# Altium schematic sheet [15] Sensors.SchDoc: Measurement sensors
size A4; Engineer: M. Folejewski; DocumentNumber: 15; SheetNumber: 15; SheetTotal: 17; PageSize: A4; Designators: 900-949
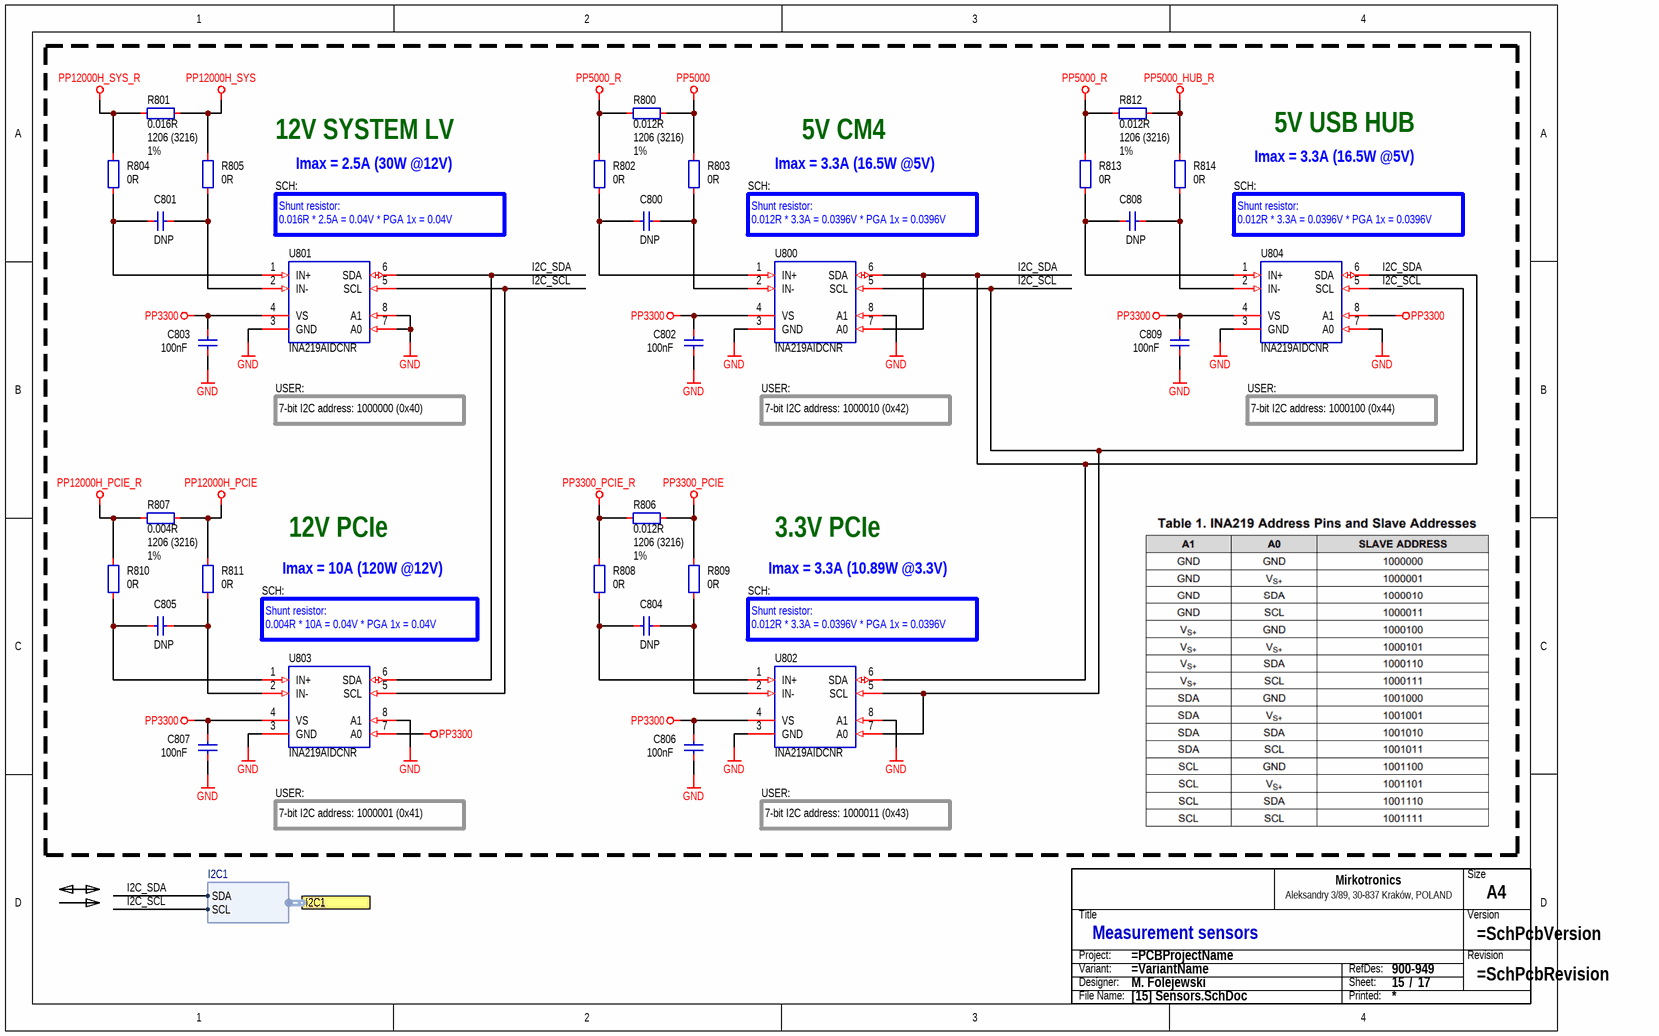
[diagram p0: [15] Sensors.SchDoc]

## Parts
C800  DNP  [CAP_0603_R]
C801  DNP  [CAP_0603_R]
C802  100nF  [CAP_0603_R]
C803  100nF  [CAP_0603_R]
C804  DNP  [CAP_0603_R]
C805  DNP  [CAP_0603_R]
C806  100nF  [CAP_0603_R]
C807  100nF  [CAP_0603_R]
C808  DNP  [CAP_0603_R]
C809  100nF  [CAP_0603_R]
R800  0.012R  Package (Case): 1206 (3216)  Tolerance: 1%  [RES_1206_R]
R801  0.016R  Package (Case): 1206 (3216)  Tolerance: 1%  [RES_1206_R]
R802  0R  [RES_0603_R]
R803  0R  [RES_0603_R]
R804  0R  [RES_0603_R]
R805  0R  [RES_0603_R]
R806  0.012R  Package (Case): 1206 (3216)  Tolerance: 1%  [RES_1206_R]
R807  0.004R  Package (Case): 1206 (3216)  Tolerance: 1%  [RES_1206_R]
R808  0R  [RES_0603_R]
R809  0R  [RES_0603_R]
R810  0R  [RES_0603_R]
R811  0R  [RES_0603_R]
R812  0.012R  Package (Case): 1206 (3216)  Tolerance: 1%  [RES_1206_R]
R813  0R  [RES_0603_R]
R814  0R  [RES_0603_R]
TB?  Title block  (value not drawn)  (graphical)
U800  INA219AIDCNR  [ICC_SOT23-8_290X160X100P65]
U801  INA219AIDCNR  [ICC_SOT23-8_290X160X100P65]
U802  INA219AIDCNR  [ICC_SOT23-8_290X160X100P65]
U803  INA219AIDCNR  [ICC_SOT23-8_290X160X100P65]
U804  INA219AIDCNR  [ICC_SOT23-8_290X160X100P65]

## Ports
I2C1 (harness I2C1)

## Harnesses
I2C1: SDA, SCL

## Nets
GND: C802.1 C803.1 C806.1 C807.1 C809.1 U800.3(GND) U800.8(A1) U801.3(GND) U801.7(A0) U801.8(A1) U802.3(GND) U802.8(A1) U803.3(GND) U803.8(A1) U804.3(GND) U804.7(A0)
PP3300: C802.2 C803.2 C806.2 C807.2 C809.2 U800.4(VS) U801.4(VS) U802.4(VS) U803.4(VS) U803.7(A0) U804.4(VS) U804.8(A1)
PP3300_PCIE: R806.2 R809.2
PP3300_PCIE_R: R806.1 R808.2
PP5000: R800.2 R803.2
PP5000_HUB_R: R812.2 R814.2
PP5000_R: R800.1 R802.2 R812.1 R813.2
PP12000H_PCIE: R807.2 R811.2
PP12000H_PCIE_R: R807.1 R810.2
PP12000H_SYS: R801.2 R805.2
PP12000H_SYS_R: R801.1 R804.2
I2C_SCL: U800.5(SCL) U801.5(SCL) U802.5(SCL) U802.7(A0) U803.5(SCL) U804.5(SCL) ; port I2C1.SCL
I2C_SDA: U800.6(SDA) U800.7(A0) U801.6(SDA) U802.6(SDA) U803.6(SDA) U804.6(SDA) ; port I2C1.SDA
NetC800_1: C800.1 R802.1 U800.1(IN+)
NetC800_2: C800.2 R803.1 U800.2(IN-)
NetC801_1: C801.1 R804.1 U801.1(IN+)
NetC801_2: C801.2 R805.1 U801.2(IN-)
NetC804_1: C804.1 R808.1 U802.1(IN+)
NetC804_2: C804.2 R809.1 U802.2(IN-)
NetC805_1: C805.1 R810.1 U803.1(IN+)
NetC805_2: C805.2 R811.1 U803.2(IN-)
NetC808_1: C808.1 R813.1 U804.1(IN+)
NetC808_2: C808.2 R814.1 U804.2(IN-)

## Notes on the sheet
- 12V SYSTEM LV
- Imax = 2.5A (30W @12V)
- Imax = 3.3A (16.5W @5V)
- 5V CM4
- 5V USB HUB
- (near U801) Shunt resistor:
  0.016R * 2.5A = 0.04V * PGA 1x = 0.04V
- SCH:
- Shunt resistor:
  0.012R * 3.3A = 0.0396V * PGA 1x = 0.0396V
- 7-bit I2C address: 1000000 (0x40)
- USER:
- 7-bit I2C address: 1000010 (0x42)
- 7-bit I2C address: 1000100 (0x44)
- Imax = 10A (120W @12V)
- 12V PCIe
- Imax = 3.3A (10.89W @3.3V)
- 3.3V PCIe
- Shunt resistor:
  0.004R * 10A = 0.04V * PGA 1x = 0.04V
- 7-bit I2C address: 1000001 (0x41)
- 7-bit I2C address: 1000011 (0x43)
- (in symbol SCH_TITLE_BLOCK_MIRKOTRONICS_V2) Size; Mirkotronics; Aleksandry 3/89, 30-837 Kraków, POLAND; Title; Version; Project:; Revision; Variant:; RefDes:; Designer:; Sheet:; /; File Name:; Printed:

## Library data of the parts
C800 C801 C804 C805 C808 = CAP-0023: Capacitor; MLCC; GENERIC; TBD; TBD; TBD; TBD; SMD; 0603 (1608);; ID: CAP-0023; Component Type: Capacitor; Component Subtype: MLCC; Value: DNP; Manufacturer: GENERIC; MPN: DNP; Mounting Type: SMD; Package (Case): 0603 (1608); Component Body: TBD; Component Height: TBD; Packaging Type: TBD; ROHS Status: TBD; Operating Temperature: TBD; Capacitance: DNP; Voltage Rating: TBD; Dielectric: TBD; Tolerance: TBD; Features: TBD; Supplier 1: LCSC
C802 C803 C806 C807 C809 = CAP-0008: Capacitor; MLCC; 100nF; TBD; TBD; TBD; TBD; SMD; 0603 (1608);; Component Type: Capacitor; Component Subtype: MLCC; Value: 100nF; Manufacturer: TBD; MPN: TBD; Mounting Type: SMD; Package (Case): 0603 (1608); Supplier: ?; Supplier 1: LCSC; Supplier Part Number 1: C14663
R800 R801 R806 R807 R812 = RES-0060: Resistor; Thick Film; GENERIC; TBD; TBD; TBD; TBD; TBD; SMD; 1206 (3216);; ID: RES-0060; Component Type: Resistor; Component Subtype: Thick Film; Manufacturer: GENERIC; MPN: GENERIC; Mounting Type: SMD; Component Body: TBD; Component Height: TBD; Packaging Type: TBD; ROHS Status: TBD; Operating Temperature: TBD; Power Rating: TBD; TCR: TBD; Voltage Rating: TBD; Features: TBD; Supplier 1: LCSC
  R800 R806 R812: Value: 0.012R; Resistance: 0.012R; Supplier Part Number 1: C723448
  R801: Value: 0.016R; Resistance: 0.016R; Supplier Part Number 1: C2904218
  R807: Value: 0.004R; Resistance: 0.004R; Supplier Part Number 1: C5120913
R802-R805 R808-R811 R813 R814 = RES-0052: Resistor; Thick Film; 0R; 1%; TBD; TBD; TBD; Standard; SMD; 0603 (1608);; Component Body: 1.60 x 0.80mm; ID: RES-0052; Component Type: Resistor; Component Subtype: Thick Film; Value: 0R; Manufacturer: TBD; MPN: TBD; Mounting Type: SMD; Package (Case): 0603 (1608); Component Height: 0.45mm; Packaging Type: TBD; ROHS Status: TBD; Operating Temperature: TBD; Resistance: 0R; Tolerance: 1%; Power Rating: TBD; TCR: TBD; Voltage Rating: TBD; Features: Standard; Supplier 1: LCSC; Supplier Part Number 1: C21189
TB? = SCH_TITLE_BLOCK_MIRKOTRONICS_V2: Component Type: Title block; Manufacturer: -; Mounting Type: Non component; MPN: -; Operating Temperature: -; Package: -; Specification: Title block; Value: Title block; Replacement: -; System: ?
U800-U804 = ICC_TXI_INA219_SOT23-8: IC; Current Monitor;; Manufacturer: Texas Instruments; Specification: Bidirectional Current/Power Monitor, I2C, SOT-23-8 package; Component Type: IC; Mounting Type: SMD; MPN: INA219AIDCNR; Operating Temperature: -40°C to +85°C; Package: SOT-23-8; Value: INA219AIDCNR; Component Subtype: Current monitor; Supplier 1: LCSC; Supplier Part Number 1: C87469